# Altium schematic sheet FPGA_HEADER.SchDoc
size A; DocumentNumber: 13; SheetNumber: 13; SheetTotal: 13
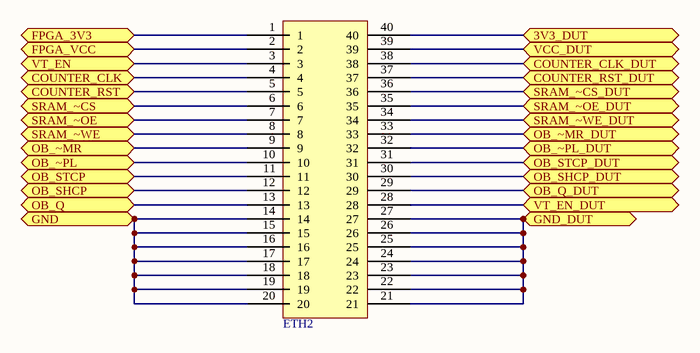
[diagram p0: FPGA_HEADER.SchDoc]

## Parts
ETH2  ADAFRUIT_HEADER  [FEMALE_HEADER_SMD]  (value not drawn)

## Ports
3V3_DUT, COUNTER_CLK, COUNTER_CLK_DUT, COUNTER_RST, COUNTER_RST_DUT, FPGA_3V3, FPGA_VCC, GND, GND_DUT, OB_Q, OB_Q_DUT, OB_SHCP, OB_SHCP_DUT, OB_STCP, OB_STCP_DUT, OB_~MR, OB_~MR_DUT, OB_~PL, OB_~PL_DUT, SRAM_~CS, SRAM_~CS_DUT, SRAM_~OE, SRAM_~OE_DUT, SRAM_~WE, SRAM_~WE_DUT, VCC_DUT, VT_EN, VT_EN_DUT

## Nets
3V3_DUT: ETH2.40 ; port 3V3_DUT
COUNTER_CLK: ETH2.4 ; port COUNTER_CLK
COUNTER_CLK_DUT: ETH2.38 ; port COUNTER_CLK_DUT
COUNTER_RST: ETH2.5 ; port COUNTER_RST
COUNTER_RST_DUT: ETH2.37 ; port COUNTER_RST_DUT
FPGA_3V3: ETH2.1 ; port FPGA_3V3
FPGA_VCC: ETH2.2 ; port FPGA_VCC
GND: ETH2.14 ETH2.15 ETH2.16 ETH2.17 ETH2.18 ETH2.19 ETH2.20 ; port GND
GND_DUT: ETH2.21 ETH2.22 ETH2.23 ETH2.24 ETH2.25 ETH2.26 ETH2.27 ; port GND_DUT
OB_Q: ETH2.13 ; port OB_Q
OB_Q_DUT: ETH2.29 ; port OB_Q_DUT
OB_SHCP: ETH2.12 ; port OB_SHCP
OB_SHCP_DUT: ETH2.30 ; port OB_SHCP_DUT
OB_STCP: ETH2.11 ; port OB_STCP
OB_STCP_DUT: ETH2.31 ; port OB_STCP_DUT
OB_~MR: ETH2.9 ; port OB_~MR
OB_~MR_DUT: ETH2.33 ; port OB_~MR_DUT
OB_~PL: ETH2.10 ; port OB_~PL
OB_~PL_DUT: ETH2.32 ; port OB_~PL_DUT
SRAM_~CS: ETH2.6 ; port SRAM_~CS
SRAM_~CS_DUT: ETH2.36 ; port SRAM_~CS_DUT
SRAM_~OE: ETH2.7 ; port SRAM_~OE
SRAM_~OE_DUT: ETH2.35 ; port SRAM_~OE_DUT
SRAM_~WE: ETH2.8 ; port SRAM_~WE
SRAM_~WE_DUT: ETH2.34 ; port SRAM_~WE_DUT
VCC_DUT: ETH2.39 ; port VCC_DUT
VT_EN: ETH2.3 ; port VT_EN
VT_EN_DUT: ETH2.28 ; port VT_EN_DUT

## Library data of the parts
ETH2 = ADAFRUIT_HEADER: Extra tall female header (SMD)